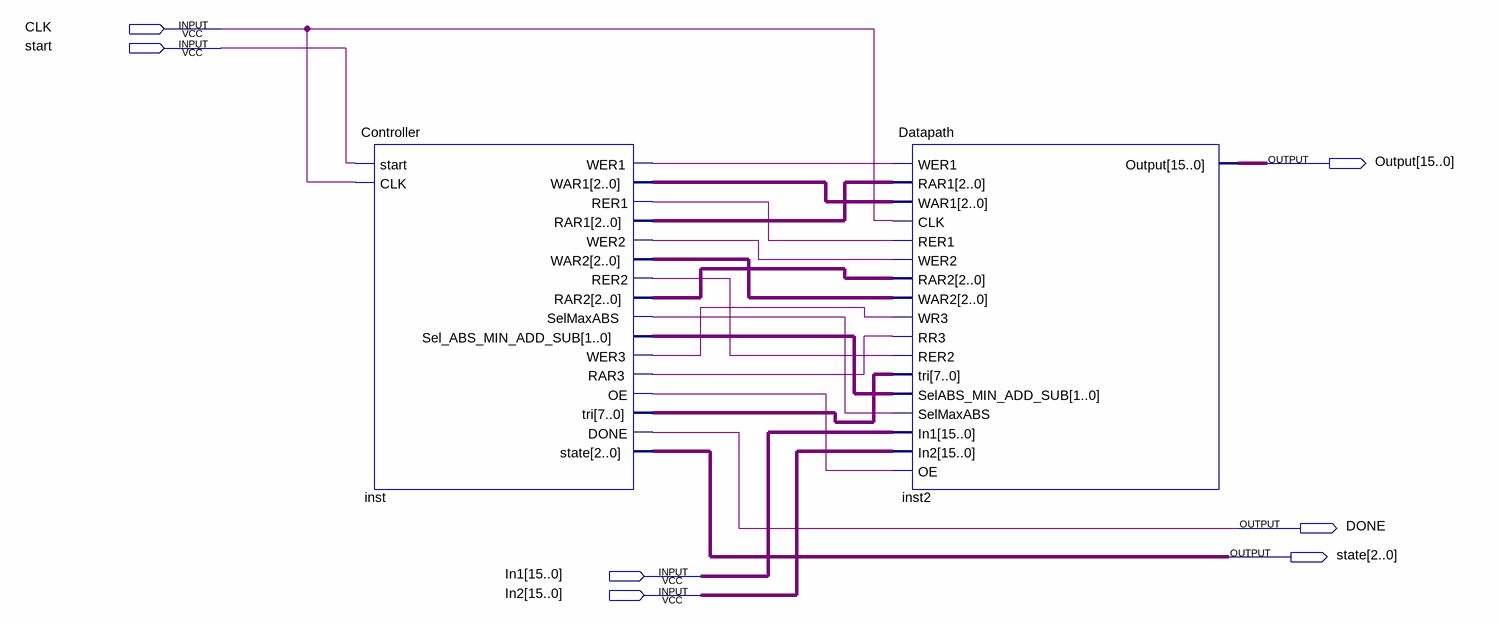
[diagram p0: schematic sheet]
// Quartus schematic square_root.bdf as structural Verilog: 2 symbols, 7 pins
module square_root (
  input  CLK,
  input  start,
  input  [15:0] In1,
  input  [15:0] In2,
  output [15:0] Output,
  output DONE,
  output [2:0] state
);

  wire inst_oe, inst_rar3, inst_rer1, inst_rer2, inst_selmaxabs, inst_wer1, inst_wer2, inst_wer3;
  wire [1:0] inst_sel_abs_min_add_sub;
  wire [2:0] inst_rar1, inst_rar2, inst_war1, inst_war2;
  wire [7:0] inst_tri;

  Controller inst (
    .start(start), .CLK(CLK), .WER1(inst_wer1), .WAR1(inst_war1), .RER1(inst_rer1), .RAR1(inst_rar1),
    .WER2(inst_wer2), .WAR2(inst_war2), .RER2(inst_rer2), .RAR2(inst_rar2), .SelMaxABS(inst_selmaxabs),
    .Sel_ABS_MIN_ADD_SUB(inst_sel_abs_min_add_sub), .WER3(inst_wer3), .RAR3(inst_rar3), .OE(inst_oe),
    .\tri (inst_tri), .DONE(DONE), .state(state));
  Datapath inst2 (
    .WER1(inst_wer1), .RAR1(inst_rar1), .WAR1(inst_war1), .CLK(CLK), .RER1(inst_rer1), .WER2(inst_wer2),
    .RAR2(inst_rar2), .WAR2(inst_war2), .WR3(inst_wer3), .RR3(inst_rar3), .RER2(inst_rer2), .\tri (inst_tri),
    .SelABS_MIN_ADD_SUB(inst_sel_abs_min_add_sub), .SelMaxABS(inst_selmaxabs), .In1(In1), .In2(In2),
    .OE(inst_oe), .Output(Output));
endmodule
